# EAGLE design highpowerboard (EAGLE 9.2.2)
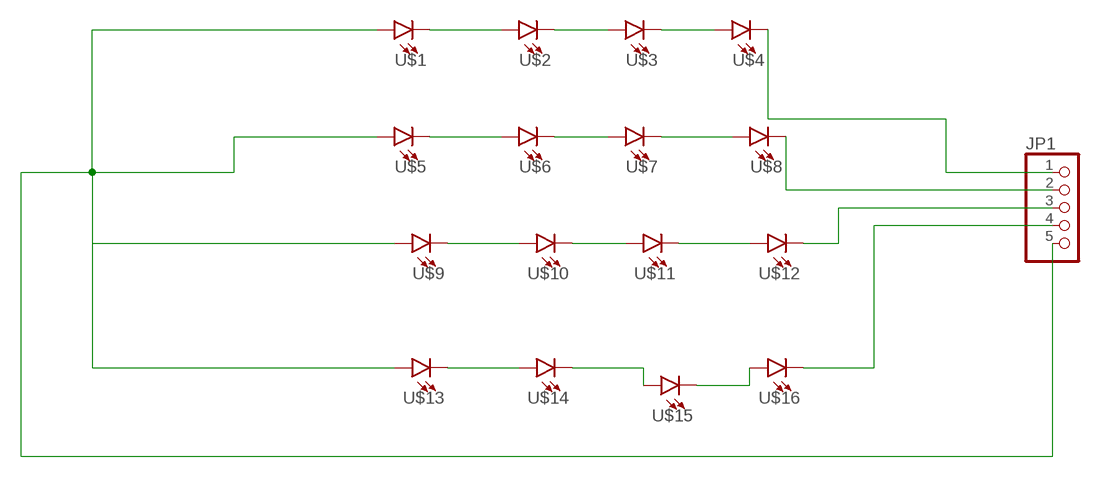
[diagram p0: schematic, sheet 1]

## Parts
JP1  PINHD-1X05_2.54-SMD-90°  [1X05SMD/90]
U$1  LEDHIGHPOWER  [HIGHPOWERLED]
U$2  LEDHIGHPOWER  [HIGHPOWERLED]
U$3  LEDHIGHPOWER  [HIGHPOWERLED]
U$4  LEDHIGHPOWER  [HIGHPOWERLED]
U$5  LEDHIGHPOWER  [HIGHPOWERLED]
U$6  LEDHIGHPOWER  [HIGHPOWERLED]
U$7  LEDHIGHPOWER  [HIGHPOWERLED]
U$8  LEDHIGHPOWER  [HIGHPOWERLED]
U$9  LEDHIGHPOWER  [HIGHPOWERLED]
U$10  LEDHIGHPOWER  [HIGHPOWERLED]
U$11  LEDHIGHPOWER  [HIGHPOWERLED]
U$12  LEDHIGHPOWER  [HIGHPOWERLED]
U$13  LEDHIGHPOWER  [HIGHPOWERLED]
U$14  LEDHIGHPOWER  [HIGHPOWERLED]
U$15  LEDHIGHPOWER  [HIGHPOWERLED]
U$16  LEDHIGHPOWER  [HIGHPOWERLED]

## Nets
N$1: U$1.PI$(C) U$2.PO$(A)
N$2: U$2.PI$(C) U$3.PO$(A)
N$3: U$3.PI$(C) U$4.PO$(A)
N$4: JP1.1 U$4.PI$(C)
N$5: U$5.PI$(C) U$6.PO$(A)
N$6: U$6.PI$(C) U$7.PO$(A)
N$7: U$7.PI$(C) U$8.PO$(A)
N$8: JP1.2 U$8.PI$(C)
N$9: U$9.PI$(C) U$10.PO$(A)
N$10: U$10.PI$(C) U$11.PO$(A)
N$11: U$11.PI$(C) U$12.PO$(A)
N$12: JP1.3 U$12.PI$(C)
N$13: U$13.PI$(C) U$14.PO$(A)
N$14: U$14.PI$(C) U$15.PO$(A)
N$15: U$15.PI$(C) U$16.PO$(A)
N$16: JP1.4 U$16.PI$(C)
N$17: JP1.5 U$1.PO$(A) U$5.PO$(A) U$9.PO$(A) U$13.PO$(A)

## Library data of the parts
JP1 = pinhead-2:PINHD-1X05: PIN HEADER
U$1-U$16 = highpowerled:LEDHIGHPOWER: LED High Power piece

## Board
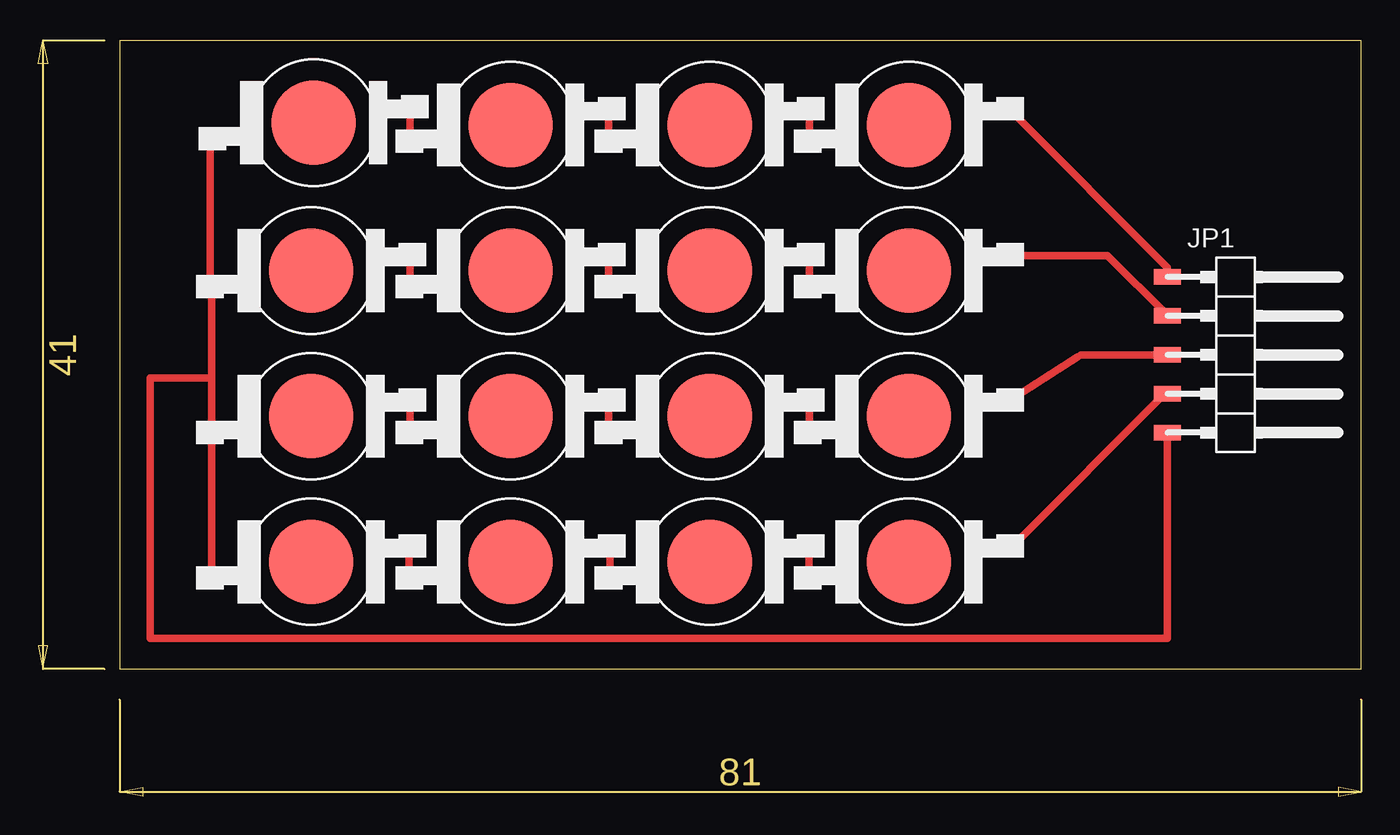
[diagram p1: board, top side]

Size 81 x 41 mm. Coordinates in mm from the lower left corner, seen from the top.
Outline: 0,0 81,0 81,41 0,41 0,0
Copper layers (1*16): Top 0.035mm / dielectric 1.5mm / Bottom 0.035mm
Design rules "default": minimum track width 6mil, minimum drill 0.35mm, track to track 6mil, track to pad 6mil, pad to pad 6mil, via to via 6mil, smd to smd 6mil, copper to edge 40mil, drill to drill 6mil, minimum pad ring 10mil, minimum via ring 8mil, stop-mask expansion 4mil, vias tented up to drill 0mil, thermal gap 10mil

### Footprints (pad centres in the part's own frame; a part is rotated, then mirrored left to right if it is on the bottom)
1X05SMD/90 = smd 1.016 x 1.778: 1 -1.27,-5.08; 2 1.27,-5.08; 3 3.81,-5.08; 4 6.35,-5.08; 5 8.89,-5.08
HIGHPOWERLED = smd 5.5 x 5.5: PAD 0,0 | smd 1.5 x 1.8: PI$ -1.05,6.6; PO$ 1.05,-6.6

### Placement (x,y rotation side)
JP1  73.44,24.31 270 top
U$1  12.67,35.66 270 top
U$2  25.5,35.5 270 top
U$3  38.5,35.5 270 top
U$4  51.5,35.5 270 top
U$5  12.5,26 270 top
U$6  25.5,26 270 top
U$7  38.5,26 270 top
U$8  51.5,26 270 top
U$9  12.5,16.5 270 top
U$10  25.5,16.5 270 top
U$11  38.5,16.5 270 top
U$12  51.5,16.5 270 top
U$13  12.5,7 270 top
U$14  25.5,7 270 top
U$15  38.5,7 270 top
U$16  51.5,7 270 top

### Tracks (layer width: path | path; a pad name or v marks a point on that pad's centre or on a via)
N$1
  Top 0.5: U$2.PO$ 18.95,34.48 18.95,36.3 19.25,36.61 U$1.PI$
N$2
  Top 0.5: U$3.PO$ 31.9,34.48 31.9,36.3 32.05,36.46 U$2.PI$
N$3
  Top 0.5: U$4.PO$ 45.01,34.48 45.01,36.46 U$3.PI$
N$4
  Top 0.5: JP1.1 68.36,26.21 58.11,36.46 U$4.PI$
N$5
  Top 0.5: U$6.PO$ 18.95,25.03 18.95,26.86 19.1,27.01 U$5.PI$
N$6
  Top 0.5: U$7.PO$ 31.9,25.03 31.9,26.86 32.05,27.01 U$6.PI$
N$7
  Top 0.5: U$8.PO$ 45.01,25.03 45.01,27.01 U$7.PI$
N$8
  Top 0.5: U$8.PI$ 58.16,26.99 64.44,26.99 68.37,23.05
N$9
  Top 0.5: U$10.PO$ 18.95,15.58 18.95,17.25 19.1,17.41 U$9.PI$
N$10
  Top 0.5: U$11.PO$ 31.9,15.58 31.9,17.25 32.05,17.41 U$10.PI$
N$11
  Top 0.5: U$12.PO$ 45.01,15.58 45.01,17.41 U$11.PI$
N$12
  Top 0.5: JP1.3 63.06,20.5 62.72,20.5 62.5,20.36 U$12.PI$
N$13
  Top 0.5: U$14.PO$ 18.91,6.09 18.91,7.76 19.06,7.91 U$13.PI$
N$14
  Top 0.5: U$15.PO$ 32.01,6.09 32.01,7.91 U$14.PI$
N$15
  Top 0.5: U$16.PO$ 44.97,6.09 44.97,7.91 U$15.PI$
N$16
  Top 0.5: U$16.PI$ 58.26,8.05 68.17,17.96 JP1.4
N$17
  Top 0.5: 6,15.42 5.99,15.43 U$9.PO$ | JP1.5 68.36,2 2,2 2,19 6,19 | 6,19 6,15.42 | 6,19 6,25.02 5.99,25.03 U$5.PO$ 5.9,34.44 U$1.PO$ | 6,15.42 6,6.05 U$13.PO$